# EasyEDA Pro project source.epro, board Active_Acoustic_Impedance_Controller_C11_35
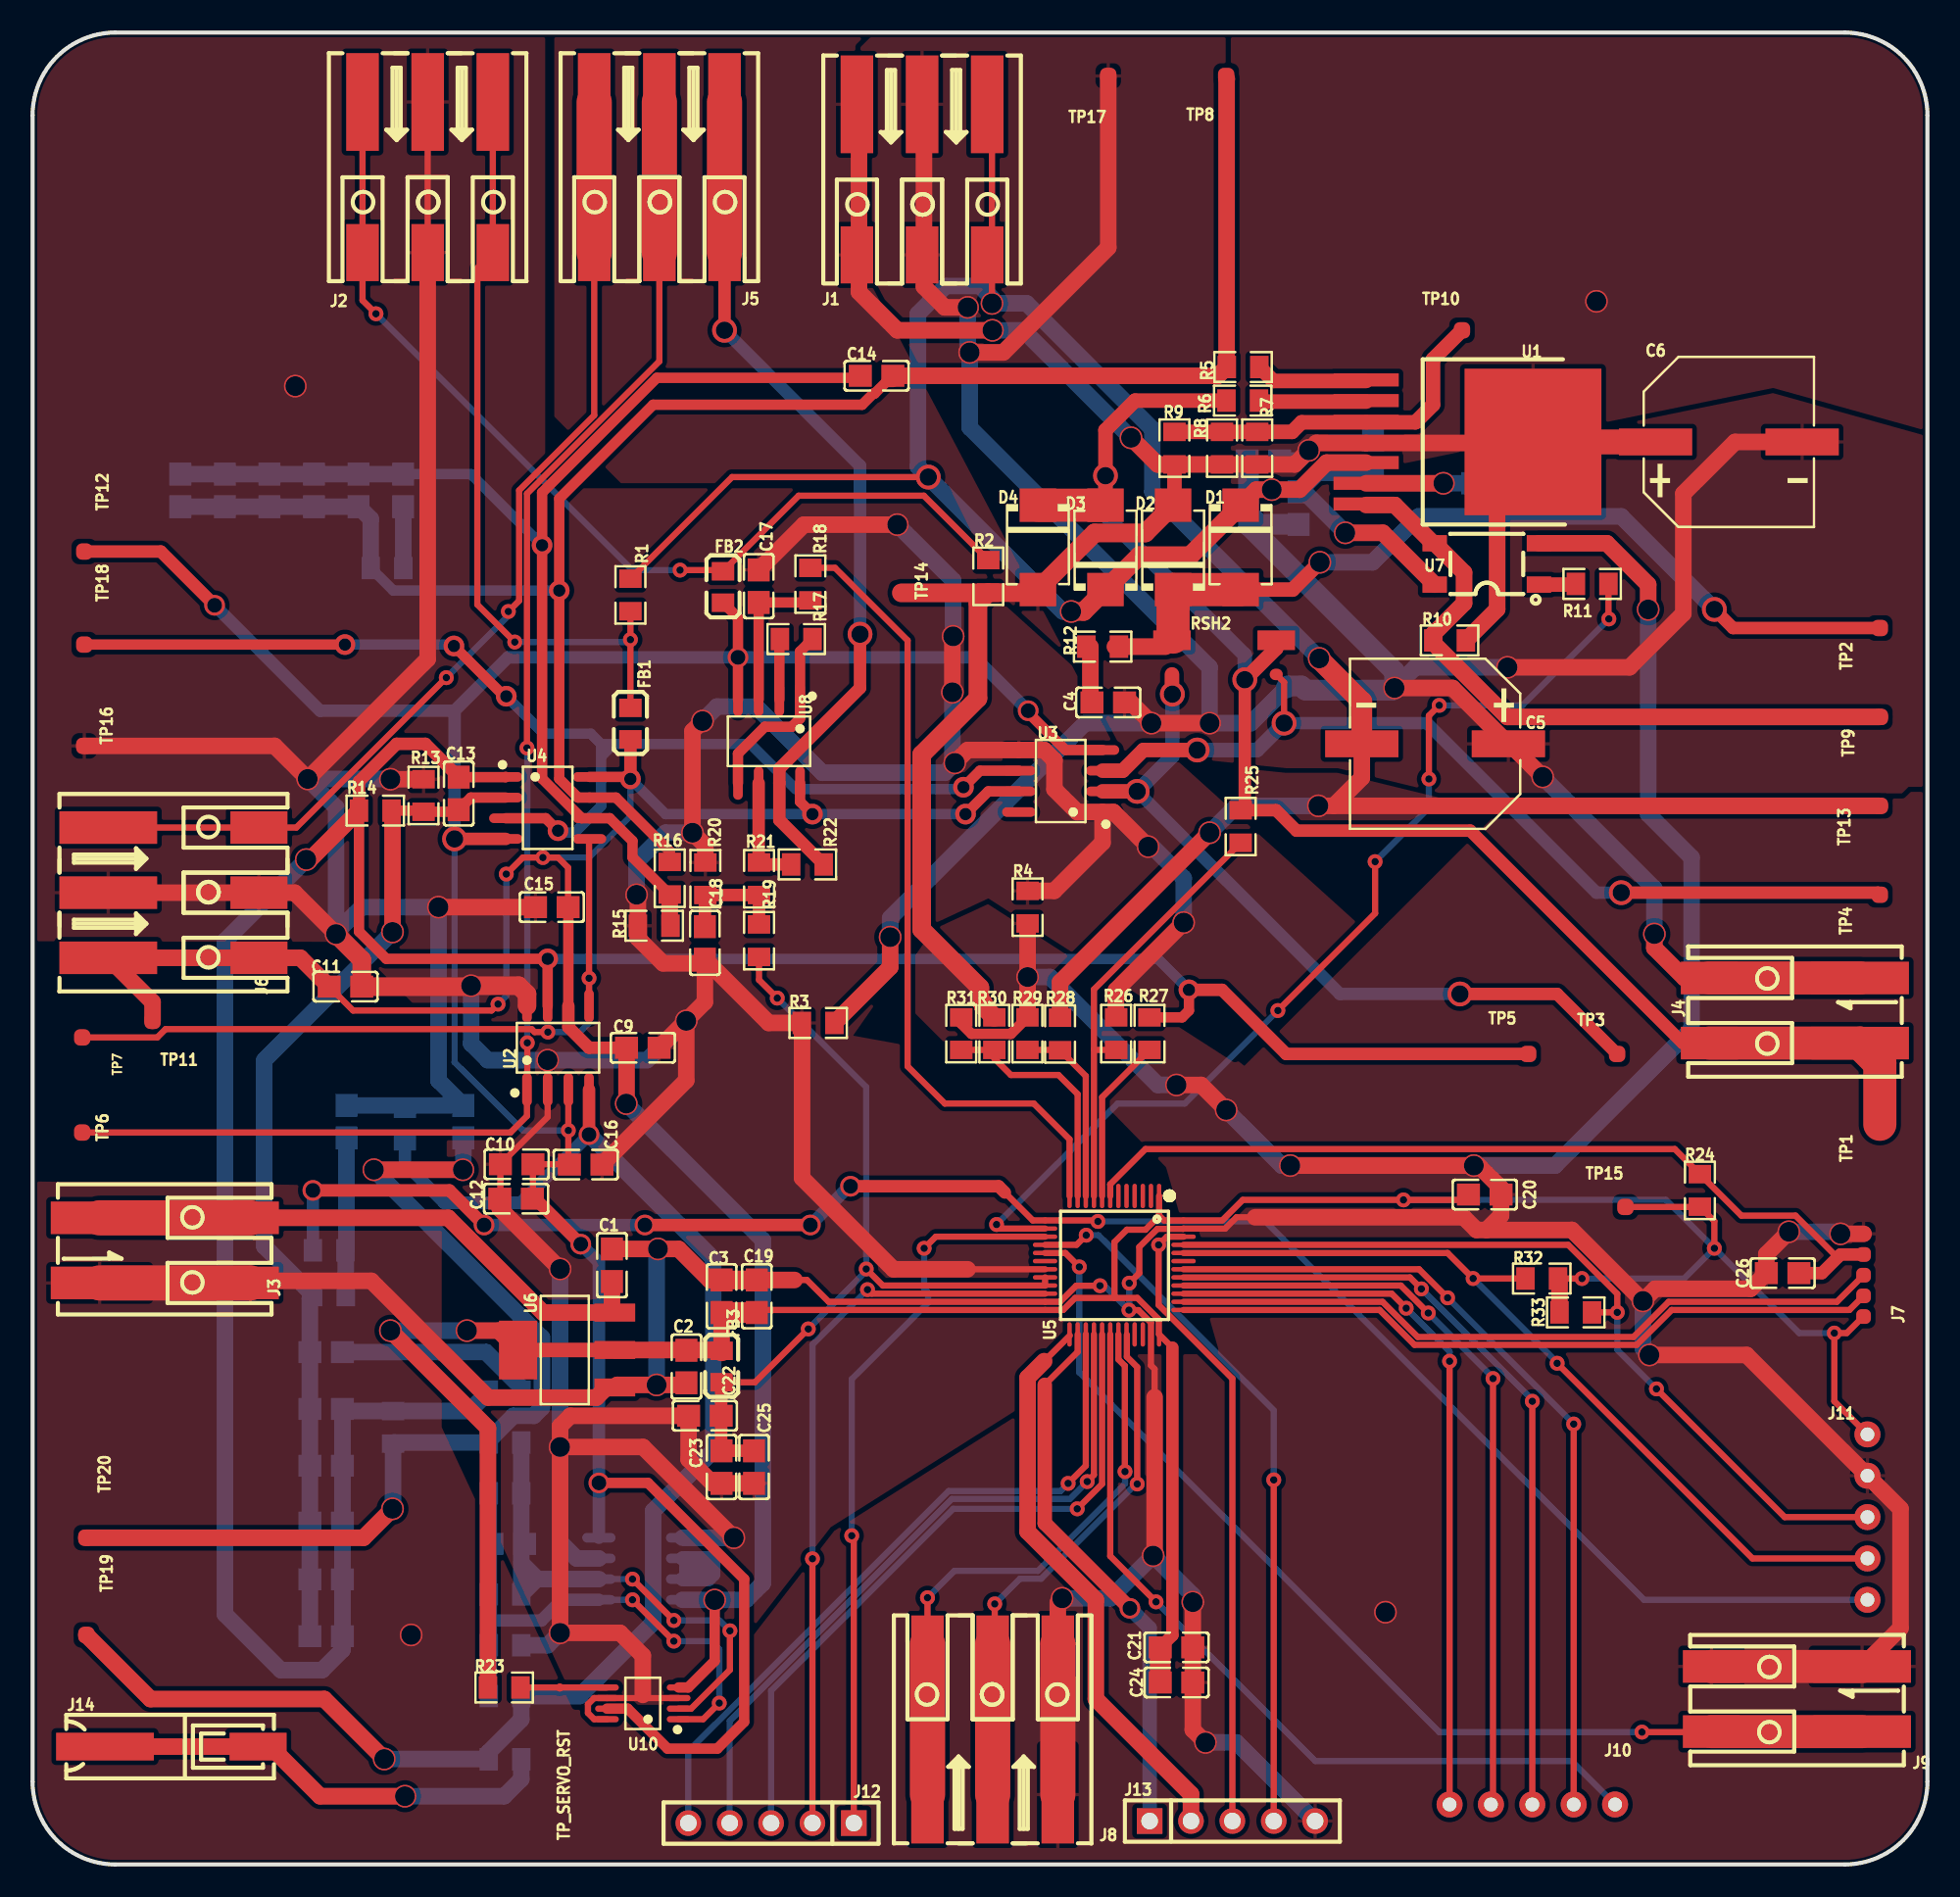
[diagram p1: board, top side]
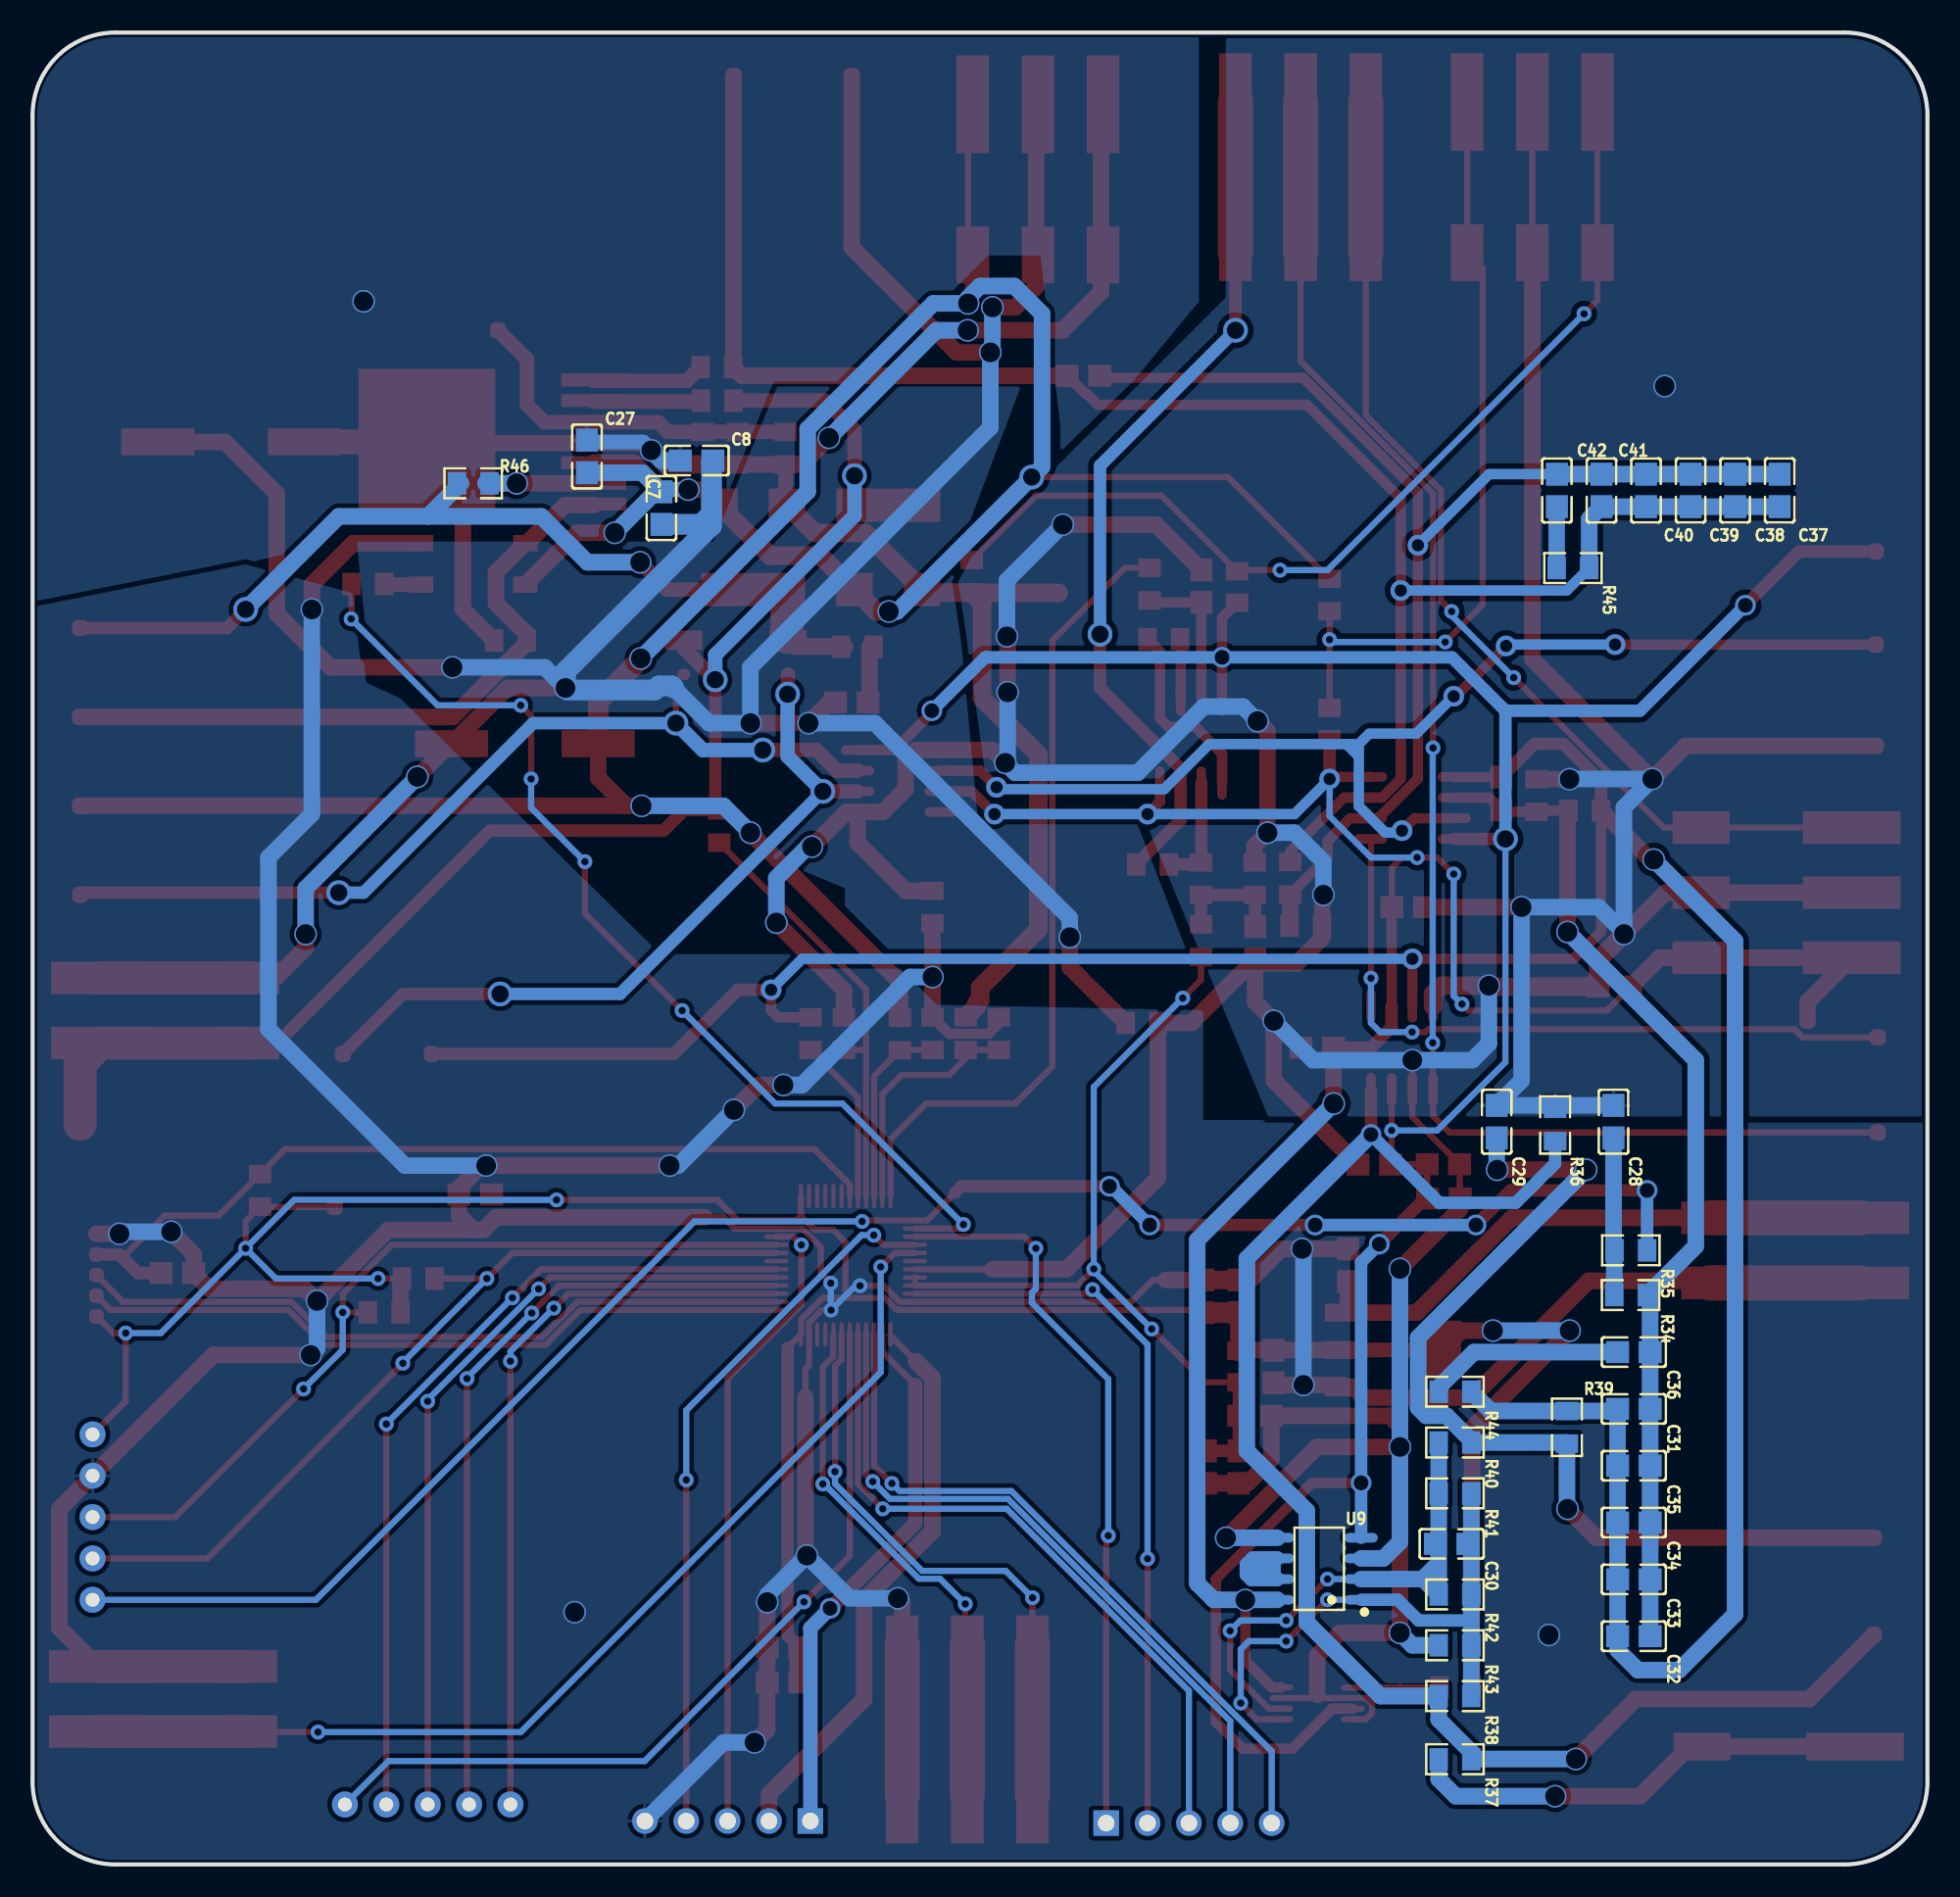
[diagram p2: board, bottom side, seen from below]

Outline 116.33 x 112.52 mm; copper layers: Top Layer, Bottom Layer. Coordinates in mm from the lower left corner of the outline.
Outline path: 0,107.44 0,5.08 arc(1.49,1.49) 5.08,0 111.25,0 arc(114.84,1.49) 116.33,5.08 116.33,107.44 arc(114.84,111.03) 111.25,112.52 5.08,112.52 arc(1.49,111.03) 0,107.44
Stack: Top Layer 0.035mm / Dielectric1 1.51mm FR4 er 4.5 / Bottom Layer 0.035mm

## Design rules (mm)
spacing safeClearance (default): track to track 0.102, other pairs 0.102 to 0.3
spacing Plane_innerPlane: track to track 0.102, other pairs 0.102 to 0.3
spacing Copper_copperRegion: track to track 0.102, other pairs 0.102 to 0.3
spacing Copper_copperRegion_Copper_copperRegion: track to track 0.102, other pairs 0.102 to 0.3
spacing Copper_copperRegion_safeClearance: track to track 0.102, other pairs 0.102 to 0.3
track width trackWidth (default): min 0.127, default 0.254, max 2.54
differential pair differentialPair (default): width min 0.127, default 0.254, max 2.54; gap min 0.152, default 0.152
pour e1260 uses Copper_copperRegion, copperRegion_Copper_copperRegion
pour e1281 uses Copper_copperRegion, copperRegion_Copper_copperRegion
pour e1296 uses Copper_copperRegion, copperRegion_Copper_copperRegion
pour e1321 uses Copper_copperRegion, copperRegion_Copper_copperRegion
pour e1323 uses Copper_copperRegion, copperRegion_Copper_copperRegion
pour e1325 uses Copper_copperRegion, copperRegion_Copper_copperRegion
pour e1332 uses Copper_copperRegion, copperRegion_Copper_copperRegion
pour e1343 uses Copper_copperRegion, copperRegion_Copper_copperRegion
pour e1430 uses Copper_copperRegion, copperRegion_Copper_copperRegion
net $1N56724 uses copperRegion_safeClearance

## Placement (name value [footprint] x y rotation side)
C1  10uF  [C0805]  35.57 36.81 90 top
C2  10uF  [C0805]  40.14 30.58 270 top
C3  100nF  [C0805]  42.3 34.9 90 top
C4  47nF 100V  [C0805]  66.04 71.37 0 top
C5  470uF 35V  [CAP-SMD_BD10.0-L10.3-W10.3-LS11.3-FD]  86.11 68.83 180 top
C6  470uF 35V  [CAP-SMD_BD10.0-L10.3-W10.3-LS11.3-FD]  104.14 87.38 0 top
C7  100nF  [C0805]  77.72 83.31 270 bottom
C8  100nF  [C0805]  75.56 86.23 0 bottom
C9  100nF  [C0805]  37.47 50.17 0 top
C10  100nF  [C0805]  29.72 43.01 180 top
C11  1uF  [C0805]  19.21 53.92 0 top
C12  1uF  [C0805]  29.69 40.89 180 top
C13  68pF C0G DNP/tune  [C0805]  26.16 65.79 270 top
C14  150pF C0G DNP/tune  [C0805]  51.82 91.44 180 top
C15  100nF  [C0805]  31.88 58.8 180 top
C16  100nF  [C0805]  33.96 42.99 0 top
C17  10nF  [C0805]  44.58 78.52 90 top
C18  100nF  [C0805]  41.28 56.6 270 top
C19  100nF  [C0805]  44.46 34.9 90 top
C20  100nF  [C0805]  89.15 41.15 0 top
C21  100nF  [C0805]  70.23 13.34 0 top
C22  100nF  [C0805]  41.28 27.56 180 top
C23  220nF ±10% 50V X7R  [C0805]  42.3 24.41 270 top
C24  4.7uF  [C0805]  70.23 11.18 0 top
C25  1uF  [C0805]  44.29 24.41 270 top
C26  100nF NRST  [C0805]  107.44 36.32 180 top
C27  10pF  [C0805]  82.3 86.49 90 bottom
C28  100nF TRIM_LPF DNP  [C0805]  19.27 45.62 90 bottom
C29  1uF IPORT_LPF DNP  [C0805]  26.44 45.62 90 bottom
C30  1uF SERVO_INT DNP  [C0805]  29.21 19.69 0 bottom
C31  4.7p COMP_A DNP  [C0805]  18.02 27.98 180 bottom
C32  10p COMP_A DNP  [C0805]  18.02 14.02 180 bottom
C33  22p COMP_A DNP  [C0805]  18.02 17.51 180 bottom
C34  47p COMP_A DNP  [C0805]  18.02 21 180 bottom
C35  100p COMP_A DNP  [C0805]  18.02 24.49 180 bottom
C36  10p-100p LEAD_A_C DNP  [C0805]  18.02 31.47 180 bottom
C37  4.7p COMP_B DNP  [C0805]  9.07 84.4 90 bottom
C38  10p COMP_B DNP  [C0805]  11.8 84.4 90 bottom
C39  22p COMP_B DNP  [C0805]  14.54 84.4 90 bottom
C40  47p COMP_B DNP  [C0805]  17.28 84.4 90 bottom
C41  100p COMP_B DNP  [C0805]  20.01 84.4 90 bottom
C42  10p-100p LEAD_B_C DNP  [C0805]  22.75 84.4 90 bottom
D1  SS56 +clamp DRV  [SMB_L4.3-W3.6-LS5.4-RD]  74.17 80.9 270 top
D2  SS56 -clamp DRV  [SMB_L4.3-W3.6-LS5.4-RD]  70.02 80.9 90 top
D3  SS56 +clamp SPK DNP  [SMB_L4.3-W3.6-LS5.4-RD]  65.87 80.9 90 top
D4  SS56 -clamp SPK DNP  [SMB_L4.3-W3.6-LS5.4-RD]  61.72 80.9 270 top
FB1  Ferrite/0R ANA_P  [L0805]  36.7 70.08 270 top
FB2  Ferrite/0R ANA_N  [L0805]  42.39 78.47 270 top
FB3  Ferrite/0R MCU_3V3A  [L0805]  42.3 30.58 270 top
J1  2060-453/998-404  [CONN-SMD_2060-453]  54.61 103.49 270 top
J2  2060-453/998-404  [CONN-SMD_2060-453]  24.26 103.63 270 top
J3  2060-452/998-404  [CONN-SMD_2060-452]  8.74 37.72 0 top
J4  SPEAKER WAGO 2060 SMT 2P  [CONN-SMD_2060-452]  107.57 52.45 180 top
J5  2060-453/998-404  [CONN-SMD_2060-453]  38.48 103.63 270 top
J6  2060-453/998-404  [CONN-SMD_2060-453]  9.27 59.69 0 top
J7  SWD bare SMT pads  [AAI_C11_35_LOCAL_Footprints:AAI_PinHeader_1x05_P1_27mm_Vertical]  112.41 36.2 180 top
J8  UART bare SMT pads  [CONN-SMD_2060-453]  58.94 8.92 90 top
J9  FAULT bare SMT pads  [CONN-SMD_2060-452]  107.7 10.16 180 top
J10  EXP_SPI_TIM_DNP  [AAI_C11_35_LOCAL_Footprints:AAI_PinHeader_1x05_P2_54mm_Vertical]  92.07 3.68 90 top
J11  EXP_I2C_DAC_DNP  [AAI_C11_35_LOCAL_Footprints:AAI_PinHeader_1x05_P2_54mm_Vertical]  112.65 21.34 0 top
J12  2.54-1*5P母  [HDR-TH_5P-P2.54-V-F]  45.34 2.54 180 top
J13  2.54-1*5P母  [HDR-TH_5P-P2.54-V-F]  73.66 2.67 0 top
J14  2060-451/998-404  [CONN-SMD_L12.7-W3.9_2060-451-998-404]  9.14 7.24 0 top
R1  0R DNP link PWR_P->ANA_P  [R0805]  36.7 77.98 270 top
R2  0R DNP link PWR_N->ANA_N  [R0805]  58.67 79.12 90 top
R3  0R STAR PGND-AGND  [R0805]  48.23 51.69 180 top
R4  0R STAR AGND-DGND  [R0805]  61.09 58.8 270 top
R5  100R  [R0805]  74.32 91.98 0 top
R6  0R FB  [R0805]  74.29 89.92 0 top
R7  57.6k 1A DEFAULT  [R0805]  75.18 87 270 top
R8  33.2k 1.5A DNP  [R0805]  73.03 87 270 top
R9  22.1k 2A DNP  [R0805]  70.1 87 270 top
R10  100k E/S pulldown default disable  [R0805]  87 75.18 0 top
R11  1.0k  [R0805]  95.75 78.66 180 top
R12  4.7R 2W  [R0805]  65.7 74.8 180 top
R13  1kΩ  [R0805]  24 65.66 90 top
R14  49.9kΩ  [R0805]  21.04 64.73 0 top
R15  1kΩ  [R0805]  38.16 57.66 180 top
R16  39kΩ  [R0805]  39.12 60.58 270 top
R17  0R feedback  [R0805]  46.88 75.27 180 top
R18  100R  [R0805]  47.75 78.64 270 top
R19  59.0k 0.1%  [R0805]  44.6 56.74 90 top
R20  10.0k 0.1%  [R0805]  41.3 60.55 90 top
R21  10.0k 0.1%  [R0805]  44.6 60.55 270 top
R22  6.49k 0.1%  [R0805]  47.57 61.43 180 top
R23  100K  [R0805]  28.96 10.87 0 top
R24  10k NRST pullup  [R0805]  102.36 41.4 270 top
R25  6.49k 0.1%  [R0805]  74.17 63.75 270 top
R26  10k DNP SPK mon  [R0805]  66.52 51.03 90 top
R27  100k DNP ISIG mon series  [R0805]  68.57 51.03 270 top
R28  100k DNP PWR+ mon  [R0805]  63.08 51.01 270 top
R29  10k DNP PWR+ mon  [R0805]  61.08 51.03 90 top
R30  100k DNP PWR- mon  [R0805]  59.05 51.03 270 top
R31  10k DNP PWR- mon  [R0805]  57.01 51.03 90 top
R32  360kΩ  [R0805]  92.65 35.99 0 top
R33  360kΩ  [R0805]  94.74 33.91 180 top
R34  1M ISIG_TRIM_INJ DNP  [R0805]  18.23 34.97 180 bottom
R35  10k TRIM_SRC DNP  [R0805]  18.21 37.72 0 bottom
R36  0R Z_GND DEFAULT  [R0805]  22.86 45.42 90 bottom
R37  1M ZTRIM_INJ DNP  [R0805]  29 6.46 180 bottom
R38  1M ZSERVO_INJ DNP  [R0805]  29 10.34 0 bottom
R39  10k IPORT_TAP DNP  [R0805]  22.13 26.85 270 bottom
R40  1M SERVO_IN DNP  [R0805]  29 25.92 0 bottom
R41  10M SERVO_FB DNP  [R0805]  29 22.8 0 bottom
R42  0R SERVO_RESET_DNP  [R0805]  29 16.58 0 bottom
R43  0R SERVO_DISABLE_DNP  [R0805]  29 13.46 0 bottom
R44  1k-10k LEAD_A_R DNP  [R0805]  29 29.04 0 bottom
R45  1k-10k LEAD_B_R DNP  [R0805]  21.76 79.63 0 bottom
R46  0R RISO default 0.05-0.2R option  [R0805]  89.28 84.84 0 bottom
RSH2  0.1R 3W 2512 current sense + Kelvin pads  [AAI_C11_35_LOCAL_Footprints:AAI_SHUNT_4T_3920_Kelvin]  73.15 74.3 0 top
TP1  TP1  [AAI_C11_35_LOCAL_Footprints:AAI_TestPoint_THTPad_D1_5mm_Drill0_7mm]  113.41 45.47 90 top
TP2  TP2  [AAI_C11_35_LOCAL_Footprints:AAI_TestPoint_THTPad_D1_5mm_Drill0_7mm]  113.41 75.95 90 top
TP3  SENSE_DRV  [AAI_C11_35_LOCAL_Footprints:AAI_TestPoint_THTPad_D1_5mm_Drill0_7mm]  97.28 49.78 0 top
TP4  SENSE_SPK  [AAI_C11_35_LOCAL_Footprints:AAI_TestPoint_THTPad_D1_5mm_Drill0_7mm]  113.41 59.56 90 top
TP5  TP5  [AAI_C11_35_LOCAL_Footprints:AAI_TestPoint_THTPad_D1_5mm_Drill0_7mm]  91.82 49.78 0 top
TP6  TP6  [AAI_C11_35_LOCAL_Footprints:AAI_TestPoint_THTPad_D1_5mm_Drill0_7mm]  3.05 44.96 90 top
TP7  TP7  [AAI_C11_35_LOCAL_Footprints:AAI_TestPoint_THTPad_D1_5mm_Drill0_7mm]  3.05 50.8 270 top
TP8  TP8  [AAI_C11_35_LOCAL_Footprints:AAI_TestPoint_THTPad_D1_5mm_Drill0_7mm]  73.28 109.86 180 top
TP9  TP9  [AAI_C11_35_LOCAL_Footprints:AAI_TestPoint_THTPad_D1_5mm_Drill0_7mm]  113.41 70.48 90 top
TP10  TP10  [AAI_C11_35_LOCAL_Footprints:AAI_TestPoint_THTPad_D1_5mm_Drill0_7mm]  87.76 94.23 0 top
TP11  TP11  [AAI_C11_35_LOCAL_Footprints:AAI_TestPoint_THTPad_D1_5mm_Drill0_7mm]  7.37 51.82 0 top
TP12  TP12  [AAI_C11_35_LOCAL_Footprints:AAI_TestPoint_THTPad_D1_5mm_Drill0_7mm]  3.17 80.65 90 top
TP13  TP13  [AAI_C11_35_LOCAL_Footprints:AAI_TestPoint_THTPad_D1_5mm_Drill0_7mm]  113.41 65.02 90 top
TP14  TP14  [AAI_C11_35_LOCAL_Footprints:AAI_TestPoint_THTPad_D1_5mm_Drill0_7mm]  53.34 78.11 90 top
TP15  TP15  [AAI_C11_35_LOCAL_Footprints:AAI_TestPoint_THTPad_D1_5mm_Drill0_7mm]  97.79 40.39 0 top
TP16  TP16  [AAI_C11_35_LOCAL_Footprints:AAI_TestPoint_THTPad_D1_5mm_Drill0_7mm]  3.17 68.71 270 top
TP17  TP17  [AAI_C11_35_LOCAL_Footprints:AAI_TestPoint_THTPad_D1_5mm_Drill0_7mm]  66.04 109.86 180 top
TP18  TP_VSENSE_RAW  [AAI_C11_35_LOCAL_Footprints:AAI_TestPoint_THTPad_D1_5mm_Drill0_7mm]  3.17 74.93 90 top
TP19  TP_AD633_Z  [AAI_C11_35_LOCAL_Footprints:AAI_TestPoint_THTPad_D1_5mm_Drill0_7mm]  3.3 14.1 90 top
TP20  TP_IPORT  [AAI_C11_35_LOCAL_Footprints:AAI_TestPoint_THTPad_D1_5mm_Drill0_7mm]  3.3 20.07 270 top
TP_SERVO_RST  -  [Test-Point-0.5mm]  32.37 10.87 0 top
U1  OPA548F/500  [TO-263-7_L10.2-W10.4-P1.27-LS14.4-TL]  87 87.38 0 top
U2  AD633ARZ-R7  [SOIC-8_L4.9-W3.9-P1.27-LS6.0-BL]  32.26 50.17 0 top
U3  INA149AIDR  [SOIC-8_L4.9-W3.9-P1.27-LS6.0-BL]  63.12 66.55 90 top
U4  OPA1656IDR  [SOIC-8_L4.9-W3.9-P1.27-LS6.0-BL]  31.62 64.9 270 top
U5  STM32G431CBT6  [LQFP-48_L7.0-W7.0-P0.50-LS9.0-BL]  66.41 36.81 180 top
U6  AMS1117-3.3  [SOT-223-3_L6.5-W3.4-P2.30-LS7.0-BR]  32.78 31.6 0 top
U7  TLP185(GR-TPR,E  [SOP-6_4P-L3.7-W4.6-P2.54-LS7.0-BL]  89.28 79.88 90 top
U8  OPA1656IDR  [SOIC-8_L4.9-W3.9-P1.27-LS6.0-BL]  45.21 68.99 180 top
U9  OPA1656IDR SERVO DNP  [SOIC-8_L4.9-W3.9-P1.27-LS6.0-BL]  37.34 18.16 90 bottom
U10  TMUX7219DGKRQ1  [VSSOP-8_L3.0-W3.0-P0.65-LS4.9-BL]  37.47 9.9 90 top

## Footprints (pads in the part's own frame, mm; a bottom-side part is the same pattern mirrored in y, then rotated)
AAI_C11_35_LOCAL_Footprints:AAI_PinHeader_1x05_P1_27mm_Vertical
  rrect 0.9x0.9 smd: 1(0,2.54) 2(0,1.27) 3(0,0) 4(0,-1.27) 5(0,-2.54)
AAI_C11_35_LOCAL_Footprints:AAI_PinHeader_1x05_P2_54mm_Vertical
  round 1.6 hole 0.85: 1(0,5.08) 2(0,2.54) 3(0,0) 4(0,-2.54) 5(0,-5.08)
AAI_C11_35_LOCAL_Footprints:AAI_SHUNT_4T_3920_Kelvin
  rect 2.3x1.2 smd: 1(-3.2,0.9) 2(3.2,0.9)
  rrect 0.8x0.7 smd: 3(-3.2,-1.2) 4(3.2,-1.2)
AAI_C11_35_LOCAL_Footprints:AAI_TestPoint_THTPad_D1_5mm_Drill0_7mm
  rrect 1x1 smd: 1(0,0)
C0805
  rect 1.41x1.35 smd: 1(-1,0) 2(1,0)
CAP-SMD_BD10.0-L10.3-W10.3-LS11.3-FD
  rect 4.5x1.65 smd: 1(-4.5,0) 2(4.5,0)
CONN-SMD_2060-452
  rect 6x2 smd: 1(-4.625,2) 2(-4.625,-2)
  rect 3.5x2 smd: 1(4.625,2) 2(4.625,-2)
CONN-SMD_2060-453
  rect 6x2 smd: 1(-4.625,4) 2(-4.625,0) 3(-4.625,-4)
  rect 3.5x2 smd: 1(4.625,4) 2(4.625,0) 3(4.625,-4)
CONN-SMD_L12.7-W3.9_2060-451-998-404
  rect 6x1.7 smd: 1(-4.7,0)
  rect 3.5x1.7 smd: 2(4.7,0)
HDR-TH_5P-P2.54-V-F
  rect 1.575x1.575 hole 1.02: 1(-5.08,0)
  round 1.575 hole 1.02: 2(-2.54,0) 3(0,0) 4(2.54,0) 5(5.08,0)
L0805
  rect 1.133x1.377 smd: 1(-0.966,0) 2(0.966,0)
LQFP-48_L7.0-W7.0-P0.50-LS9.0-BL
  oval 0.27x1.5 smd: 1(-2.75,-4.25) 2(-2.25,-4.25) 3(-1.75,-4.25) 4(-1.25,-4.25) 5(-0.75,-4.25) 6(-0.25,-4.25) 7(0.25,-4.25) 8(0.75,-4.25) 9(1.25,-4.25) 10(1.75,-4.25) 11(2.25,-4.25) 12(2.75,-4.25) 25(2.75,4.25) 26(2.25,4.25) 27(1.75,4.25) 28(1.25,4.25) 29(0.75,4.25) 30(0.25,4.25) 31(-0.25,4.25) 32(-0.75,4.25) 33(-1.25,4.25) 34(-1.75,4.25) 35(-2.25,4.25) 36(-2.75,4.25)
  oval 1.5x0.27 smd: 13(4.25,-2.75) 14(4.25,-2.25) 15(4.25,-1.75) 16(4.25,-1.25) 17(4.25,-0.75) 18(4.25,-0.25) 19(4.25,0.25) 20(4.25,0.75) 21(4.25,1.25) 22(4.25,1.75) 23(4.25,2.25) 24(4.25,2.75) 37(-4.25,2.75) 38(-4.25,2.25) 39(-4.25,1.75) 40(-4.25,1.25) 41(-4.25,0.75) 42(-4.25,0.25) 43(-4.25,-0.25) 44(-4.25,-0.75) 45(-4.25,-1.25) 46(-4.25,-1.75) 47(-4.25,-2.25) 48(-4.25,-2.75)
R0805
  rect 1.133x1.377 smd: 1(-1,0) 2(1,0)
SMB_L4.3-W3.6-LS5.4-RD
  rect 2.047x2.241 smd: 1(-2.591,0) 2(2.591,0)
SOIC-8_L4.9-W3.9-P1.27-LS6.0-BL
  oval 0.588x2.045 smd: 1(-1.905,-2.57) 2(-0.635,-2.57) 3(0.635,-2.57) 4(1.905,-2.57) 5(1.905,2.57) 6(0.635,2.57) 7(-0.635,2.57) 8(-1.905,2.57)
SOP-6_4P-L3.7-W4.6-P2.54-LS7.0-BL
  rect 1.001x1.5 smd: 1(-1.27,-3.2) 3(1.27,-3.2) 4(1.27,3.2) 6(-1.27,3.2)
SOT-223-3_L6.5-W3.4-P2.30-LS7.0-BR
  rect 2.5x1.1 smd: 1(2.97,-2.3) 2(2.97,0) 3(2.97,2.3)
  rect 2.34x3.6 smd: 4(-2.97,0)
Test-Point-0.5mm
  round 0.5 smd: 1(0,0)
TO-263-7_L10.2-W10.4-P1.27-LS14.4-TL
  rect 4x0.8 smd: 1(-5.122,3.81) 2(-5.122,2.54) 3(-5.122,1.27) 4(-5.122,0) 5(-5.122,-1.27) 6(-5.122,-2.54) 7(-5.122,-3.81)
  rect 8.4x9 smd: 8(5.122,0)
VSSOP-8_L3.0-W3.0-P0.65-LS4.9-BL
  oval 0.38x1.45 smd: 1(-0.975,-2.2) 2(-0.325,-2.2) 3(0.325,-2.2) 4(0.975,-2.2) 5(0.975,2.2) 6(0.325,2.2) 7(-0.325,2.2) 8(-0.975,2.2)

## Nets
As in the schematic.

Pads without a net: U3 8; U5 2 3 4 5 6 18 33 34 43

## Via types
v1: diameter 1.397, hole 1.219, Top Layer to Bottom Layer, 72 vias
v2: diameter 0.914, hole 0.457, Top Layer to Bottom Layer, 66 vias
v3: diameter 1.524, hole 1.067, Top Layer to Bottom Layer, 13 vias
v4: diameter 1.27, hole 0.762, Top Layer to Bottom Layer, 12 vias
v5: diameter 1.27, hole 0.914, Top Layer to Bottom Layer, 12 vias

## Routing (per net, layer and track width the routed paths; a pad name or vN(x,y) marks a point on that pad's centre or on a via; arc(x,y) is an arc through that point)
AGND: length 410.5
  Top Layer w0.381: J2.2 J2.2 ; 57.4,36.56 U5.19 ; C12.2 28.72,40.93 C10.2 31.62,45.91 U2.2 v1(31.62,49.4) ; U10.3 U10.6 34.48,10.22 34.1,9.84 34.1,9.3 34.48,8.92 U10.8
  Top Layer w1.016: C15.2 v1(24.92,58.8) ; v1(56.47,72) 56.47,75.39 v1(56.51,75.44) ; v1(32.38,25.64) 32.38,26.92 33.02,27.56 C22.2 40.28,24.88 41.74,23.41 C23.2 C25.2 ; v1(32.38,25.64) v1(32.38,14.22) 36.07,14.22 37.47,12.83 37.47,10.41 ; v1(32.38,25.64) 37.48,25.64 v1(43.05,20.07) ; C18.2 45.19,51.69 R3.2 47.24,51.67 47.24,42.16 52.85,36.56 57.4,36.56 ; C18.2 41.02,55.35 38.71,55.35 37.16,56.9 R15.2 37.16,59.48 v1(37.08,59.56) ; C18.2 41.28,52.98 C9.2 ; R13.2 v1(21.97,66.66) ; v1(56.62,67.66) 57.41,68.45 U3.5 62.1,68.45 62.74,67.82 62.74,66.04 64.13,64.64 U3.1 ; R4.1 62.72,59.8 65.69,62.77 U3.1 ; C16.2 40.13,48.16 v1(40.13,51.82) ; v1(18.63,57.15) 16.09,59.69 J6.2 J6.2 ; v1(70.67,57.85) 66.51,53.7 66.51,52.05 R26.2 ; C12.2 28.69,40.28 v1(32.38,36.58) ; U3.1 66.36,64.64 v1(68.49,62.52) ; TP16.1 14.86,68.71 v1(16.89,66.68) 24.26,74.04 J2.2 ; C17.2 47.36,82.3 v1(53.09,82.3) ; R20.2 41.3,62.58 v1(40.51,63.37) 40.51,69.61 v1(41.13,70.23)
  Top Layer w1.143: U2.8 30.35,53.47 29.84,53.98 v1(26.92,53.98) 26.87,53.92 C11.2 20.21,55.57 v1(18.63,57.15)
  Bottom Layer w1.016: v1(53.09,82.3) 56.51,78.87 v1(56.51,75.44) ; U9.5 v1(43.05,20.07) ; v1(41.13,70.23) 42.02,71.12 44.42,71.12 48.49,67.06 56.01,67.06 v1(56.62,67.66) 56.47,67.81 v1(56.47,72) ; v1(37.08,59.56) 37.08,61.6 38.86,63.37 v1(40.51,63.37) ; v1(26.92,53.98) 26.92,50.42 27.94,49.4 v1(31.62,49.4) 37.72,49.4 v1(40.13,51.82) ; R43.2 31.62,13.46 v1(32.38,14.22) ; v1(21.97,66.66) 21.95,66.68 v1(16.89,66.68) 18.63,64.94 18.63,57.24 20.19,58.8 v1(24.92,58.8) 24.92,48.15 C29.2 C28.2 ; v1(70.67,57.85) 70.67,60.59 68.74,62.52 v1(68.49,62.52) ; v1(32.38,36.58) v1(32.38,25.64) 32.38,19.81 33.4,18.8 U9.3
  vias: v1(16.13,90.81)
DGND: length 336.5
  Top Layer w0.381: 46.78,35.9 47.54,35.9 48.88,34.56 U5.23 63.09,34.56 64.07,35.55 v2(65.53,35.55) ; v2(67.31,34.05) 67.89,34.05 68.66,33.28 68.66,30.65 68.88,30.43 68.88,28.7 ; 75.06,39.75 73.91,39.75 73.22,39.06 U5.47 70.64,39.04 69.06,39.04 67.94,37.93 67.94,36.32 v2(67.33,35.71)
  Top Layer w0.635: R29.2 60.06,51.02 57.65,51.02 57.01,51.65 R31.2
  Top Layer w1.016: v1(77.22,42.93) 88.77,42.93 90.15,41.55 C20.2 90.15,39.86 89.26,38.97 ; J9.2 114.68,14.52 114.68,21.84 J11.2 105.23,31.29 v1(99.26,31.29) ; C2.2 40.01,29.46 v1(38.31,29.46) 35.9,29.46 35.75,29.3 35.24,29.3 34.62,28.68 27.97,28.68 20.8,35.85 13.5,35.85 13.37,35.72 ; C1.2 v1(38.39,37.81) 39.66,37.81 41.57,35.9 C3.2 ; 61.09,52.04 v1(61.09,54.51) R4.2 ; v1(72.01,7.49) 71.23,8.27 C24.2 C21.2 v1(71.23,16.11) ; v1(111,38.73) 112.41,38.73 ; 75.06,39.75 87.87,39.75 88.65,38.97 89.26,38.97 ; C19.2 46.78,35.9 ; v1(73.28,46.34) 71.74,47.88 v1(70.23,47.88) ; v1(68.8,18.97) 68.88,19.06 68.88,28.7 ; v1(63.21,16.35) 62.94,16.08 J8.3 ; v1(107.82,38.86) 106.44,37.48 C26.2 105.48,35.36 99.61,35.36 v1(98.87,34.61) 94.5,38.97 89.26,38.97 ; v1(99.19,77.09) 99.19,78.61 96.65,81.15 U7.3
  Top Layer w1.143: C3.2 C19.2
  Top Layer w2.032: J9.2 J9.2
  Top Layer w2.159: J8.3 J8.3 ; 13.37,35.72 4.12,35.72
  Bottom Layer w0.381: v2(67.33,35.71) 67.33,34.07 v2(67.31,34.05) 65.81,35.55 v2(65.53,35.55)
  Bottom Layer w1.016: J13.5 73.91,7.49 v1(72.01,7.49) ; v1(38.31,29.46) 38.31,37.72 v1(38.39,37.81) ; v1(98.87,34.61) 98.87,31.69 v1(99.26,31.29) ; v1(99.19,77.09) 99.19,64.52 101.85,61.85 101.85,51.31 93.47,42.93 88.39,42.93 ; v1(63.21,16.35) 66.17,16.35 v1(68.8,18.97) 71.23,16.53 v1(71.23,16.11) ; v1(107.82,38.86) 110.87,38.86 v1(111,38.73) ; v1(70.23,47.88) 69.09,47.88 62.46,54.51 v1(61.09,54.51) ; v1(77.22,42.93) 76.7,42.93 v1(73.28,46.34)
  vias: v1(23.24,14.1) v1(83.06,15.49) v1(88.48,42.93)
PGND: length 209
  Top Layer w1.016: C6.2 104.52,87.38 101.35,84.2 101.35,76.84 98.04,73.53 v1(90.55,73.53) ; v1(57.53,92.88) 59.6,92.88 66.04,99.31 TP17.1 ; v1(52.65,56.96) 52.65,55.11 R3.1 ; v1(99.57,57.15) 99.57,56.29 101.41,54.45 102.27,54.45 ; v1(92.71,66.8) 90.68,68.83 C5.1 87.18,72.26 v1(83.62,72.26) ; J1.2 54.61,107.99 54.72,107.87 54.72,96.91 55.99,95.64 v1(57.4,95.64) ; C4.2 67.42,71.37 v1(68.69,70.1) v1(72.26,70.1)
  Top Layer w2.032: J4.2 J4.2
  Bottom Layer w1.016: v1(57.4,95.64) 57.4,93 v1(57.53,92.88) 57.53,88.27 72.26,73.53 v1(72.26,70.1) 74.8,70.1 76.96,72.26 ; v1(99.57,57.15) 99.57,59.94 v1(92.71,66.8) ; v1(83.62,72.26) 84.89,73.53 v1(90.55,73.53) ; v1(68.69,70.1) 64.62,70.1 52.65,58.13 v1(52.65,56.96)
  Bottom Layer w1.27: C7.2 75.29,82.31 74.77,82.84 74.64,82.71 ; 74.64,82.71 74.64,86.16 C8.1 ; 74.64,82.71 74.64,82.22 ; 76.96,72.26 77.09,72.39 77.89,72.39 78.15,72.14 83.49,72.14 v1(83.62,72.26) 83.62,73.28 74.68,82.22
V3V3: length 185.2
  Top Layer w0.381: v2(103.25,37.85) 103.25,39.51 R24.2 102.35,40.39 TP15.1 ; 66.42,34.8 64.01,34.8 63.27,34.06 U5.24 44.62,34.06 C19.1 ; 66.42,34.8 67.82,34.8 69.14,33.48 69.14,32.58 ; 66.42,34.8 66.42,38.23 67.18,38.99 68.33,38.99 69.16,39.83 69.16,39.87 ; 69.16,39.87 69.47,39.56 U5.48 73.04,39.56 74.3,40.82 v2(84.16,40.82) 87.82,40.82 C20.1 ; 69.16,39.87 U5.1 ; 112.4,33.66 111.38,32.64 v2(110.62,32.64) 110.62,28.45 J11.1 ; U5.36 69.98,31.74 ; R32.2 v2(95.12,35.99)
  Top Layer w0.762: 69.98,31.74 69.98,14.08 C21.1
  Top Layer w0.889: U6.4 35.75,31.6
  Top Layer w1.016: U6.4 28.62,32.79 v1(26.67,32.79) ; FB3.1 C3.1 ; R23.1 27.96,26.8 v1(21.97,32.79) ; R32.2 93.74,35.9 R33.2 ; 35.75,31.6 42.25,31.6
  Top Layer w1.27: C24.1 C21.1 ; 42.25,31.6 FB3.1 ; C3.1 C19.1
  Bottom Layer w0.381: v2(103.25,37.85) 108.46,32.64 v2(110.62,32.64) ; v2(103.25,37.85) 101.39,35.99 v2(95.12,35.99) ; v2(103.25,37.85) 100.28,40.82 v2(84.16,40.82)
  Bottom Layer w1.016: v1(21.97,32.79) v1(26.67,32.79)
V3V3A: length 51.9
  Top Layer w0.381: v2(47.62,32.89) 44.35,29.62 FB3.2 ; v2(45.72,53.21) 44.6,54.33 R19.1 ; v2(51.18,36.58) 52.2,35.56 U5.21 U5.20
  Top Layer w0.762: FB3.2 42.28,29.59 C22.1 42.28,25.43 C23.1 C25.1
  Bottom Layer w0.381: v2(45.72,53.21) 51.18,47.75 v2(51.18,36.58) 51.18,36.45 v2(47.62,32.89)
V5_IN: length 36
  Top Layer w1.016: J3.1 25.52,39.72 31.34,33.9 35.75,33.9 35.57,34.07 C1.1
  Top Layer w2.159: J3.1 J3.1
AD633_Z: length 95.4
  Top Layer w0.762: U2.4 v5(34.16,44.83)
  Top Layer w1.016: TP19.1 7.24,10.16 17.91,10.16 v1(21.59,6.48)
  Bottom Layer w0.762: R36.1 22.86,43.06 25.27,40.64 29.97,40.64 v5(34.16,44.83)
  Bottom Layer w1.016: v1(21.59,6.48) 27.99,6.48 R37.2 28,6.91 30,8.91 R38.2 33.58,10.34 38.1,14.86 38.1,21.72 41.78,25.4 41.78,37.21 v5(34.16,44.83)
ADC_ISIG: length 10.2
  Top Layer w0.381: U5.8 65.66,47.12 R27.2
ADC_PWR_N: length 14.8
  Top Layer w0.381: U5.11 64.16,47.31 62.98,48.49 60.06,48.49 59.05,49.51 R30.2 R31.1
ADC_PWR_P: length 11.6
  Top Layer w0.381: U5.10 64.66,48.43 R28.2 63.06,50.03 R29.1
ADC_SPK: length 26.8
  Top Layer w0.381: 65.16,50.06 U5.9 ; 65.16,50.06 65.19,50.03 R26.1 ; 65.16,50.06 65.16,53.75 R25.2
ADC_TEMP: length 44
  Top Layer w0.381: v2(76.2,23.62) J13.4 ; v2(64.69,38.65) 64.09,38.06 U5.16
  Bottom Layer w0.381: v2(76.2,23.62) 76.2,27.89 65.44,38.65 v2(64.69,38.65)
ANA_N: length 172
  Top Layer w0.381: C12.1 30.72,40.93 C10.1 32.94,43.01 ; 32.94,43.01 C16.1 ; 32.94,43.01 32.89,43.05 v2(32.89,45.09) U2.3
  Top Layer w0.635: U10.7 36.53,9.57 38.99,7.11 42.04,7.11 43.69,8.76 43.69,17.53 37.78,23.44 v5(34.77,23.44) ; v5(61.12,70.87) 61.12,70.74 63.41,68.45 U3.4 ; FB2.2 43.31,76.58 v5(43.31,74.15) 43.31,71.56
  Top Layer w0.762: TP12.1 7.87,80.65 v5(11.18,77.34) ; v5(33.66,38.1) 30.86,40.89 C12.1 ; U4.4 v3(25.91,62.99)
  Bottom Layer w0.381: v2(32.89,45.09) 30.1,45.09 25.91,49.28 v3(25.91,62.99)
  Bottom Layer w0.762: U9.4 v5(34.77,23.44) 34.77,36.99 v5(33.66,38.1) ; v5(11.18,77.34) 17.65,70.87 25.91,70.87 ; v5(61.12,70.87) 57.84,74.15 v5(43.31,74.15) 29.19,74.15 25.91,70.87 ; 25.91,70.87 v3(25.91,62.99)
ANA_N_EXT: length 61
  Top Layer w0.381: v2(39.75,79.5) 42.32,79.5 ; FB2.1 47.03,84.07 54.72,84.07 R2.2 ; J2.3 J2.3 20.26,96.08 v2(21.08,95.25)
  Bottom Layer w0.381: v2(21.08,95.25) 36.83,79.5 v2(39.75,79.5)
ANA_P: length 146.5
  Top Layer w0.381: v2(29.08,60.83) 30.1,61.85 v2(31.33,61.85) 32.26,61.85 32.88,61.23 C15.1 ; v2(28.58,52.84) 28.18,52.45 19.68,52.45 C11.1
  Top Layer w0.635: 32.89,52.82 32.89,58.79 C15.1 ; v1(41.88,16.24) 41.88,12.5 40.25,10.87 U10.4 ; U8.8 47.12,65.28 v4(47.88,64.52) ; v4(36.7,66.68) 36.58,66.8 U4.8 ; v4(57.28,64.52) 58.67,65.91 60.55,65.91
  Top Layer w0.762: C9.1 34.16,50.17 32.89,51.44 U2.6 ; v4(36.7,66.68) FB1.2
  Top Layer w1.016: v1(36.45,46.74) 36.47,46.75 C9.1 ; C11.1 16.44,55.69 J6.3 J6.3 7.37,52.97 TP11.1
  Bottom Layer w0.381: v2(29.08,60.83) 29.08,53.35 v2(28.58,52.84) ; v4(36.7,66.68) 36.7,64.39 34.16,61.85 v2(31.33,61.85)
  Bottom Layer w0.635: v4(36.7,66.68) 38.86,64.52 v4(47.88,64.52) v4(57.28,64.52)
  Bottom Layer w1.016: U9.8 43.81,16.26 44.83,17.27 44.83,38.35 v1(36.45,46.74)
ANA_P_EXT: length 47.6
  Top Layer w0.381: J2.1 J2.1 27.3,98.06 27.3,77.39 v2(29.6,75.09) ; FB1.1 v2(36.7,75.23) R1.2
  Bottom Layer w0.381: v2(29.6,75.09) 36.56,75.09 v2(36.7,75.23)
DAC_AUX_RAW: length 111.5
  Top Layer w0.381: 59.69,41.28 61.41,39.56 U5.13 65.34,39.56 v2(65.41,39.5)
  Top Layer w0.762: v5(17.21,41.4) 25.59,41.4 v5(27.72,39.28) ; v5(50.22,41.66) 59.31,41.66 59.69,41.28 ; v5(37.59,39.28) v5(47.75,39.28)
  Bottom Layer w0.381: J11.5 98.93,16.26 75.69,39.5 v2(65.41,39.5)
  Bottom Layer w0.762: v5(47.75,39.28) 50.13,41.66 v5(50.22,41.66) ; v5(27.72,39.28) v5(37.59,39.28) ; R35.1 v5(17.21,41.4)
DAC_BUF: length 11.7
  Top Layer w0.635: U8.5 43.31,68.23 44.96,69.88 46.61,69.88 47.12,70.39 47.12,74.5 R17.1
DAC_BUF_N: length 3.7
  Top Layer w0.635: R17.2 45.85,75.23 45.85,71.56
DAC_R_FILT: length 9.2
  Top Layer w0.635: 44.58,71.56 C17.1 47.62,77.52 R18.2
DAC_R_RAW: length 49.3
  Top Layer w0.381: U5.12 63.66,44.54 61.47,46.74 56.01,46.74 53.72,49.02 53.72,75.18 49.26,79.64 R18.1
DRV: length 56.8
  Top Layer w0.762: 103.38,76.96 104.39,75.95 TP2.1
  Top Layer w0.889: D1.2 77.35,78.31 v1(79.03,79.98)
  Top Layer w1.016: 66.45,74.8 69.56,74.8
  Top Layer w2.032: 70.02,75.39 D2.1 D1.2
  Bottom Layer w1.016: 92.07,82.8 85.09,82.8 82.27,79.98 v1(79.03,79.98) ; 92.07,82.8 90.03,84.84 ; 92.07,82.8 97.54,82.8 v3(103.25,77.09)
FAULT_IN: length 66.2
  Top Layer w0.381: v2(64.26,36.7) 63.41,37.56 U5.17 ; J9.1 103.04,8.13 v2(98.81,8.13)
  Top Layer w2.032: J9.1 J9.1
  Bottom Layer w0.381: v2(98.81,8.13) 86.36,8.13 64.26,30.23 v2(64.26,36.7)
GPIO_SPARE1: length 45.1
  Top Layer w0.381: v2(50.29,20.19) 50.42,20.07 J12.1 ; v2(54.74,37.85) 55.45,38.56 U5.15
  Bottom Layer w0.381: v2(50.29,20.19) 50.29,29.81 54.98,34.5 54.98,35.12 54.74,35.36 v2(54.74,37.85)
GPIO_SPARE2: length 44.9
  Top Layer w0.381: v2(47.88,18.78) J12.2 ; U5.22 51.51,35.06 v2(51.26,35.31)
  Bottom Layer w0.381: v2(51.26,35.31) 47.88,31.93 47.88,19.05
GPIO_SPARE3: length 42.9
  Top Layer w0.381: v2(64.13,21.84) 65.66,23.37 U5.29
  Bottom Layer w0.381: v2(64.13,21.84) 56.51,21.84 45.34,10.67 J12.3
GPIO_SPARE4: length 43.5
  Top Layer w0.381: U5.28 65.16,23.93 v2(64.75,23.52)
  Bottom Layer w0.381: v2(64.75,23.52) 63.69,22.45 56.44,22.45 42.8,8.81 J12.4
GPIO_SPARE5: length 44.1
  Top Layer w0.381: v2(63.58,23.41) 64.66,24.49 U5.27
  Bottom Layer w0.381: J12.5 40.26,6.95 56.24,22.94 63.11,22.94 v2(63.58,23.41)
GPIO_SPARE6: length 33.4
  Top Layer w0.381: 62.14,29.46 64.16,31.48 U5.26
  Top Layer w0.889: 62.14,29.46 62.14,20.96 v5(67.37,15.73)
  Bottom Layer w0.889: v5(67.37,15.73) 68.58,14.52 J13.1
GPIO_SPARE7: length 35.1
  Top Layer w0.381: 63.68,32.49 62.1,30.91
  Top Layer w1.016: J13.2 71.12,4.32 65.28,10.16 65.28,16.26 61.09,20.45 61.09,29.9 62.1,30.91
GPIO_SPARE8: length 39
  Top Layer w0.381: U5.46 69.64,38.56 v2(69.13,38.05) 69.13,34.37 73.66,29.84 J13.3
I2C_SCL: length 52.2
  Top Layer w0.381: 95.96,33.91 v2(97.29,33.91) 97.29,35.04 94.28,38.06 U5.45 ; v2(99.69,29.21) 107.57,21.34 J11.3
  Bottom Layer w0.381: v2(99.69,29.21) 97.29,31.61 v2(97.29,33.91)
I2C_SDA: length 53
  Top Layer w0.381: v2(93.6,30.78) 105.59,18.8 J11.4 ; U5.44 86.87,37.56 v2(88.44,35.99) 91.65,35.99
  Bottom Layer w0.381: v2(93.6,30.78) 93.6,30.83 v2(88.44,35.99)
ILIM_SET: length 21.9
  Top Layer w0.889: R9.1 R8.1 R7.1 77.33,88 77.91,88.58 84.9,88.58 85.98,89.66 85.98,92.46 TP10.1
IPORT: length 60
  Top Layer w1.016: v1(20.95,42.67) v1(26.42,42.67) ; TP20.1 20.32,20.07 v1(22.1,21.84)
  Bottom Layer w1.016: C29.1 26.44,42.7 v1(26.42,42.67) ; v1(22.1,21.84) 22.13,21.88 R39.2 22.2,25.92 R40.1 28,26.03 29.53,27.56 30.77,27.56 31.27,28.05 31.27,32.36 v1(20.95,42.67)
ISIG: length 188.1
  Top Layer w0.635: U4.1 29.04,66.79 C13.1 ; v4(70.99,53.72) 70.99,52.45 70.57,52.03 R27.1 ; U2.7 v4(31.62,55.63) 21.72,55.63 20.04,57.3 R14.1
  Top Layer w0.762: R14.1 20.04,66.52 22.35,68.83 24.11,68.83 C13.1 ; v4(70.99,53.72) 73.03,53.72 76.96,49.78 TP5.1
  Top Layer w1.016: v1(16.8,61.72) 17.03,61.72 R14.1
  Bottom Layer w0.635: v4(70.99,53.72) 69.09,55.63 v4(31.62,55.63)
  Bottom Layer w1.016: v1(16.8,61.72) 11.81,56.73 11.81,15.37 15.24,11.94 17.78,11.94 19.02,13.18 C32.1 C33.1 C34.1 C35.1 C31.1 19.15,27.85 R39.1 26.82,27.85 R44.1
ISIG_TRIM: length 9.7
  Bottom Layer w1.016: C28.1 19.27,37.78 R35.2 19.23,37.71 R34.1
MCU_OPA_EN: length 63.4
  Top Layer w0.381: v2(59.18,39.31) 59.43,39.06 U5.14 ; R11.1 96.75,76.53 v2(96.77,76.51) ; v2(86.36,71.2) 85.72,70.56 v2(85.72,66.68) ; v2(82.42,61.6) 82.42,58.42 v2(76.45,52.45)
  Bottom Layer w0.381: v2(85.72,66.68) 85.72,64.9 v2(82.42,61.6) ; v2(76.45,52.45) 70.74,46.74 66.61,46.74 v2(59.18,39.31) ; v2(96.77,76.51) 91.47,71.2 v2(86.36,71.2)
MUL_RAW: length 44.7
  Top Layer w0.381: U4.5 34.16,62.96 v2(34.16,54.44) U2.5 ; TP7.1 7.66,50.8 8.17,51.31 30.64,51.31 30.82,51.13 v2(31.64,51.13)
  Bottom Layer w0.381: v2(31.64,51.13) 33.6,51.13 34.16,51.69 v2(34.16,54.44)
NRST: length 53.5
  Top Layer w0.381: 110.82,37.29 110.8,37.29 108.23,39.85 104.91,39.85 R24.1 100.82,43.94 68.33,43.94 66.16,41.78 U5.7
  Top Layer w0.762: J7.4 111,37.47 109.85,36.32 C26.1
OPA_EN_LED_A: length 2.3
  Top Layer w0.889: R11.2 94.7,78.61 U7.1
OPA_ES: length 42.1
  Top Layer w1.016: TP9.1 90.54,70.48 86,75.03 R10.1 86,75.58 87.88,77.47 87.88,79.35 U7.4 85.98,81.15 83.63,83.5 81.88,83.5
OPA_IN_N: length 6.6
  Top Layer w0.889: 81.88,89.85 75.36,89.85 R6.2
OPA_IN_P: length 6.9
  Top Layer w0.889: R5.2 76.17,91.12 81.88,91.12
OPA_OUT: length 6.7
  Top Layer w1.016: U1.6 v1(86.61,84.84)
  Bottom Layer w1.016: v1(86.61,84.84) 88.53,84.84
PWR_N: length 136.5
  Top Layer w0.889: R9.2 70.1,83.58
  Top Layer w1.016: v1(67.44,87.63) 69.07,86 R9.2 R8.2 R7.2 77.49,86 78.8,87.31 92.12,87.31 89.92,85.11 89.92,77.11 R10.2 ; J1.3 50.74,107.99 50.74,96.58 53.09,94.23 v1(58.93,94.23)
  Top Layer w1.143: TP14.1 58.66,78.11 ; 58.66,78.11 58.04,77.49 58.04,71.63 54.58,68.17 54.58,57.43 58.16,53.86 58.16,53.1 58.38,52.88 58.38,52.7 R30.1 ; 58.66,78.11 R2.1 61.54,78.12 D4.2 65.2,81.79 68.32,81.79 D2.2
  Top Layer w1.524: 92.12,87.31 92.19,87.38 C6.1
  Bottom Layer w0.889: v1(78.35,86.86) 78.87,87.38 82.19,87.38 C27.2
  Bottom Layer w1.016: v1(78.35,86.86) 77.72,86.23 C8.2 ; v1(58.93,94.23) 60.83,94.23 v1(67.44,87.63)
  vias: v1(96.01,96.01)
PWR_P: length 199.5
  Top Layer w0.381: v1(58.9,95.89) 58.9,107.82 J1.1 ; R1.1 42.94,85.22 v3(54.99,85.22)
  Top Layer w1.016: U1.5 79.45,86.11 77.79,84.45 v1(76.08,84.45) 75.12,84.45 D1.1 ; v1(80.59,81.79) 82.9,81.79 U7.6 ; 79.88,65.02 TP13.1 ; 79.88,65.02 81.61,66.75 C5.2 ; 79.88,65.02 v1(78.94,65.02) ; v1(72.26,63.37) 63.08,54.19 R28.1
  Top Layer w1.143: v1(63.76,76.96) 64.53,76.96 D3.1 67.95,80.39 71.07,80.39 D1.1
  Top Layer w1.27: C5.2 81.61,71.43 78.99,74.04 v1(78.99,74.08)
  Bottom Layer w0.889: v1(76.08,84.45) 77.48,84.45
  Bottom Layer w1.016: v1(63.76,76.96) 63.25,76.96 v3(54.99,85.22) 54.36,85.85 54.36,95.25 56.06,96.95 58.17,96.95 58.9,96.22 v1(58.9,95.89) 61.03,95.89 68.75,88.17 68.75,84.33 v1(78.99,74.08) ; v1(72.26,63.37) 73.91,65.02 v1(78.94,65.02) ; C27.1 78.9,85.49 C7.1 ; v1(80.59,81.79) 78.08,84.31
SENSE_DRV: length 46.4
  Top Layer w0.762: v3(87.63,53.47) 93.6,53.47 TP3.1
  Top Layer w0.889: v3(69.98,71.88) 69.95,71.91 RSH2.3 ; 65.69,65.91 v3(67.82,65.91)
  Bottom Layer w0.762: v3(67.82,65.91) 80.26,53.47 v3(87.63,53.47)
  Bottom Layer w0.889: v3(69.98,71.88) 69.98,68.07 v3(67.82,65.91)
SENSE_SPK: length 56.5
  Top Layer w0.381: v3(76.84,70.1) 76.84,72.61 RSH2.4
  Top Layer w0.762: TP4.1 113.28,59.69 v3(97.54,59.69)
  Top Layer w0.889: v3(71.5,68.45) 68.2,68.45 66.93,67.18 U3.3
  Bottom Layer w0.762: v3(76.84,70.1) 85.6,70.1 96.01,59.69 v3(97.54,59.69)
  Bottom Layer w0.889: v3(71.5,68.45) 75.18,68.45 v3(76.84,70.1)
SERVO_INT_N: length 31.7
  Top Layer w0.381: v2(42.81,14.35) 42.81,11.95 40.43,9.57 U10.2 ; v2(39.37,14.99) v2(36.83,17.53)
  Bottom Layer w0.381: v2(39.37,14.99) 42.18,14.99 v2(42.81,14.35) ; v2(36.83,17.53) U9.2
  Bottom Layer w1.016: U9.2 30.95,17.53 R42.2 R41.2 R40.2 ; 30.01,18.51 30.95,17.56
SNUB_MID: length 3.5
  Top Layer w1.016: C4.1 64.94,71.47 64.94,74.8
SPI_MISO: length 49.6
  Top Layer w0.381: v2(92.07,28.45) 92.07,3.43 ; v2(85.26,35.35) 84.56,36.06 U5.41
  Bottom Layer w0.381: v2(92.07,28.45) 92.07,28.54 v2(85.26,35.35)
SPI_MOSI: length 51.5
  Top Layer w0.381: v2(94.62,27.05) 94.62,3.43 ; v2(86.87,34.8) 85.12,36.56 U5.42
  Bottom Layer w0.381: v2(94.62,27.05) 94.62,27.06 v2(86.87,34.8)
SPI_NSS: length 45.6
  Top Layer w0.381: v2(87,30.91) J10.1 ; U5.39 83.44,35.06 v2(84.33,34.17)
  Bottom Layer w0.381: v2(84.33,34.17) 87,31.5 v2(87,30.91)
SPI_SCK: length 47.6
  Top Layer w0.381: J10.2 89.66,3.81 v2(89.66,29.84) ; U5.40 84,35.56 v2(85.69,33.87)
  Bottom Layer w0.381: v2(89.66,29.84) 89.66,29.9 v2(85.69,33.87)
SPK: length 93.8
  Top Layer w0.762: J4.1 101.31,50.45 88.26,63.5 77.6,63.5 76.34,64.75 R25.1 74.42,65.01 v3(74.42,72.77)
  Top Layer w0.889: v3(74.42,72.77) 76.34,74.69 76.34,75.2 ; R6.1 67.69,89.92 65.87,88.1 v3(65.87,85.3) D3.2
  Top Layer w2.032: J4.1 J4.1 113.41,49.23 TP1.1 ; D4.1 D3.2
  Bottom Layer w0.889: v3(65.87,85.3) 65.87,82.85 74.42,74.3 v3(74.42,72.77)
SWCLK: length 44.2
  Top Layer w0.381: U5.38 82.88,34.56 85.04,32.4 98.29,32.4 100.45,34.56 110.77,34.56 J7.3
SWDIO: length 43.9
  Top Layer w0.381: U5.37 82.7,34.06 84.84,31.91 98.48,31.91 100.63,34.06 111.54,34.06 J7.2
TIM_SYNC: length 50.9
  Top Layer w0.381: v2(68.97,16.13) 66.16,18.94 U5.30
  Bottom Layer w0.381: v2(68.97,16.13) 78.75,6.35 94.49,6.35 J10.5
U4A_LEAD_MID: length 12
  Bottom Layer w1.016: 30,29.16 30,29.31 27.84,31.47 C36.1
U4A_N: length 62.7
  Top Layer w0.635: R14.2 23.93,64.73 R13.1 26.03,64.66 C13.2 26.91,65.53 U4.2
  Top Layer w1.016: v1(22.1,57.28) 22.1,64.67 R14.2
  Bottom Layer w1.016: C32.2 C33.2 C34.2 C35.2 C31.2 C36.2 17.02,34.77 R34.2 ; 17.22,34.97 14.22,37.97 14.22,49.4 v1(22.1,57.28)
U4B_LEAD_MID: length 3.8
  Bottom Layer w1.016: C42.1 22.76,83.38 R45.2
U4B_N: length 76.9
  Top Layer w0.635: R16.2 36.83,61.87 36.83,62.87 35.43,64.26 U4.6 33.72,64.26 31.28,66.7 v4(31.28,81.03) 31.28,84.27 38.33,91.31 50.36,91.31
  Top Layer w1.016: R16.2 39.12,57.7 R15.1
  Bottom Layer w0.635: v4(31.28,81.03) 26.91,85.4 C42.2
  Bottom Layer w1.016: C42.2 C41.2 C40.2 C39.2 C38.2 C37.2
UART_RX: length 33
  Top Layer w0.381: J8.2 59.07,13.67 v2(59.07,16) ; 67.18,32.54 67.18,31.18 67.82,30.55 v2(67.82,23.37)
  Top Layer w2.159: J8.2 J8.2
  Bottom Layer w0.381: v2(59.07,16) 60.62,17.55 61.92,17.55 67.74,23.37 v2(67.82,23.37)
UART_TX: length 36.5
  Top Layer w0.381: U5.31 66.66,31.02 67.06,30.63 67.06,24.14 v2(67.07,24.13) ; J8.1 v2(54.94,16.38)
  Top Layer w2.159: J8.1 J8.1
  Bottom Layer w0.381: v2(54.94,16.38) 56.59,18.03 61.72,18.03 67.07,23.38 v2(67.07,24.13)
VCMD: length 115.2
  Top Layer w0.635: R16.1 39.12,62.23 35.81,65.53 U4.7 33.49,65.53 32.33,66.68 v4(32.33,78.25) 32.33,83.9 38.1,89.66 50.93,89.66 51.61,90.35 51.69,90.35 52.41,91.06 52.83,91.06
  Top Layer w1.016: 73.32,109.68 73.31,109.67 73.31,91.99 R5.1 72.78,91.44 53.18,91.44
  Bottom Layer w0.635: R45.1 22.14,78.25 v4(32.33,78.25)
  Bottom Layer w1.016: R45.1 20.76,82.65 C41.1 C40.1 C39.1 C38.1 C37.1
VK: length 93.4
  Top Layer w0.381: TP6.1 29.34,44.96 30.35,45.97 U2.1 30.37,47.61 v2(30.37,50.47) ; J5.2 38.48,92.33 30.35,84.2 v2(30.35,68.58)
  Top Layer w2.159: J5.2 J5.2
  Bottom Layer w0.381: v2(30.37,50.47) 30.37,68.56 v2(30.35,68.58)
VK_AMP_N: length 6.9
  Top Layer w0.762: R22.2 44.72,61.43 R21.1 44.58,61.57 U8.6
VK_EXT: length 63.7
  Top Layer w0.381: v2(29.21,76.96) 29.87,77.62 29.87,84.4 34.48,89.01 J5.3 ; J6.1 J6.1 16.19,63.69 v2(25.4,72.9)
  Top Layer w2.159: J5.3 J5.3
  Bottom Layer w0.381: v2(25.4,72.9) 29.21,76.71 v2(29.21,76.96)
VK_MCU: length 53.5
  Top Layer w0.762: R22.1 45.85,64.15 U8.7 45.85,67.31 50.8,72.26 v3(50.8,75.57) ; J5.1 v3(42.48,94.23)
  Top Layer w2.159: J5.1 J5.1
  Bottom Layer w0.762: v3(42.48,94.23) 50.8,85.92 v3(50.8,75.57)
VREF_0V477: length 7.1
  Top Layer w0.762: C18.1 41.28,59.52 R20.1 R21.2 R19.2
VSENSE_RAW: length 73.1
  Top Layer w0.635: v4(57.15,66.17) 58.17,67.18 U3.6 ; TP18.1 v4(19.18,74.93) ; v4(25.87,74.84) 28.96,71.76 v4(29.08,71.76) ; v4(32.26,63.5) 31.5,64.26 U4.3
  Bottom Layer w0.635: v4(25.87,74.84) 25.78,74.93 v4(19.18,74.93) ; 34.91,68.82 34.27,69.46 31.38,69.46 v4(29.08,71.76) ; 34.91,68.82 44.09,68.82 46.86,66.04 57.03,66.04 v4(57.15,66.17) ; 34.91,68.82 34.91,65.01 33.28,63.38 32.38,63.38 v4(32.26,63.5) ; 35.59,68.74 34.96,68.1
ZSERVO_OUT: length 34.7
  Top Layer w0.381: v2(39.37,13.72) v2(36.83,16.26) ; v2(42.16,9.91) 41.17,8.92 U10.1
  Bottom Layer w0.381: v2(39.37,13.72) 41.66,13.72 42.16,13.21 v2(42.16,9.91) ; v2(36.83,16.26) U9.1
  Bottom Layer w0.762: U9.1 32.51,16.26 31.24,14.99 28.13,14.99 28,15.11
  Bottom Layer w1.016: R41.1 R42.1 R43.1 R38.1
ZTRIM: length 28.5
  Top Layer w1.016: v1(22.86,4.19) 17.65,4.19 14.6,7.24 J14.2 J14.1
  Bottom Layer w1.016: v1(22.86,4.19) 28.96,4.19 30,5.24 R37.1
$1N56724: length 7.4
  Bottom Layer w0.889: 40.15,18.16 41.64,18.16 ; 40.15,18.16 40.15,17.53 ; 40.15,18.16 40.15,18.8 ; 40.15,18.8 U9.6 ; 40.15,18.8 41.4,18.8 41.78,18.41 41.78,17.82 41.49,17.53 40.15,17.53 ; 40.15,17.53 U9.7
$1N56728: length 5.3
  Top Layer w0.381: U10.5 TP_SERVO_RST.1 R23.2

## Copper pours and planes (outline as drawn; the poured copper is in the pictures)
AGND on Top Layer: -0.51,112.65 31.5,112.65 31.5,84.96 31.9,84.56 56,84.56 59.31,77.74 81.74,57.48 73.82,49.56 58.67,59.31 55.12,57.66 50.42,50.93 63.63,48.51 69.34,42.67 72.52,31.62 66.33,31.62 49.02,20.7 40.56,9.78 33.36,9.78 25.4,26.92 25.4,50.8 19.56,56.64 -0.51,56.68
AGND on Bottom Layer: 43.16,113.28 43.16,96.29 58.51,80.95 59.59,78.77 59.18,76.07 57.95,67.09 48.13,64.14 40.53,45.85 -1.27,45.85 -9.66,113.47
DGND on Top Layer: 117.68,-1.09 -1.14,-0.84 -1.14,42 25.02,41.66 28.45,38.23 32.3,38.23 37.19,43.12 61.56,43.12 64.99,39.69 65.15,46.71 55.17,57.73 58.06,59.14 62.23,58.67 74.39,49.09 94.47,69.16 85.98,80.39 85.98,83.13 89.19,86.34 103.78,86.34 117.6,71.93
DGND on Bottom Layer: -2.03,-0.58 -2.03,45.75 44.44,45.75 44.44,55.94 77.78,55.94 96.18,74.05 96.7,78.12 103.25,79.88 117.86,76.96 118.1,46.09 118.36,39.12 118.36,27.23 116.97,25.15 120.31,3.76 111.1,-1.95 77.17,-1.95 76.45,-2.41 72.61,-3.23
PGND on Top Layer: 52.96,113.79 73.28,113 73.28,83.53 106.85,90.4 117.22,87.5 118.24,66.17 115.19,66.17 114.78,65.76 86.48,65.76 80.13,67.31 76.96,67.31 66.93,68.33 50.8,98.95 50.8,111.63
PGND on Bottom Layer: 70.64,90.81 74.55,81.28 96.45,81.28 95.59,72.78 77.47,64.52 66.48,59.94 66.48,58.86 60.71,53.09 44.14,52.74 48.48,63.91 58.24,63.91 59.74,79.91 55.63,90.81
PWR_N on Top Layer: 32,114.94 118.11,114.94 118.11,81.53 77.85,81.53 65.53,69.22 65.53,58.32 68.57,55.28 60.66,47.37 59.06,47.37 50.16,56.26 50.16,70.76 32,88.92
PWR_N on Bottom Layer: 44.7,113.79 44.83,113.67 115.44,113.67 119.13,109.98 119.13,77.34 114.97,77.34 107.14,78.97 100.38,80.57 98.47,78.66 74.57,78.66 70.1,83.12 70.1,86.36 57.66,98.81 54.48,98.81 53.26,88.44 53.26,86.72 48.77,91.06 44.7,95.98
PWR_P on Top Layer: 57.15,51.6 59.72,51.02 60.63,51.59 61.08,52.03 62.23,51.31 62.36,51.18 64.03,51.18 73.81,60.96 78.49,60.96 86.23,65 86.36,65.34 86.36,80.26 87.63,80.26 87.63,88.14 87.12,88.65 87.12,91.44 81.66,89.03 63.88,93.6 63.88,112.4 63.12,113.16 56.01,113.16 56.01,97.16 51.56,92.71 51.56,89.62 49.33,87.39 41.16,87.39 36.45,82.68 36.45,82.3 34.23,80.08 34.23,77.71 34.85,77.09 38.99,77.09 43.81,81.92 43.81,82.04 44.83,83.06 53.72,83.06 69.73,78.31
